# Altium project OBCv1.6FE.PrjPcb (part 1 of 2)
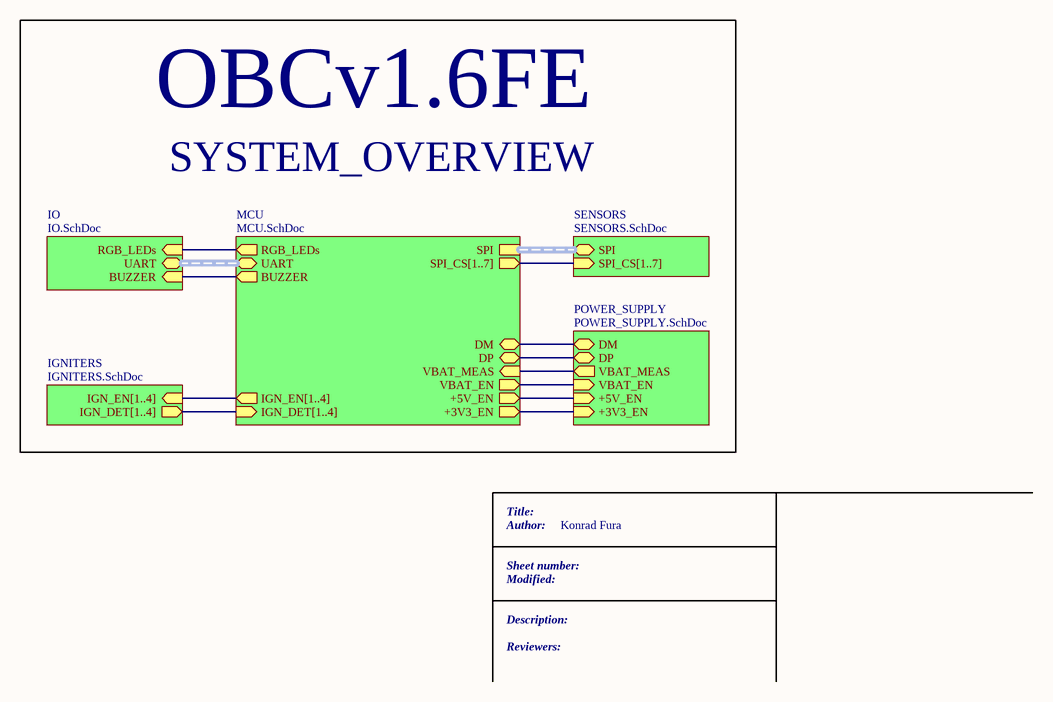
[diagram p0: SYSTEM_OVERVIEW.SchDoc]
6 sheets, 194 parts. Net scope: hierarchical (ports join the sheet entries above them; power ports are global).
Board file: OBCv1.6FE.PcbDoc
Sheets:
  SYSTEM_OVERVIEW.SchDoc
    MCU = MCU.SchDoc
    IO = IO.SchDoc
    SENSORS = SENSORS.SchDoc
    IGNITERS = IGNITERS.SchDoc
    POWER_SUPPLY = POWER_SUPPLY.SchDoc

## Sheet SYSTEM_OVERVIEW.SchDoc
size 254 x 177 mm; SheetNumber: 1; SheetTotal: 6

### Sub-sheets
IGNITERS = IGNITERS.SchDoc: IGN_EN[1..4] (in), IGN_DET[1..4] (out)
IO = IO.SchDoc: RGB_LEDs (in), UART (bidir), BUZZER (in)
MCU = MCU.SchDoc: DM (bidir), DP (bidir), IGN_DET[1..4] (in), IGN_EN[1..4] (out), RGB_LEDs (out), VBAT_EN (out), UART (bidir), VBAT_MEAS (in), SPI, SPI_CS[1..7] (out), +5V_EN (out), +3V3_EN (out), BUZZER (out)
POWER_SUPPLY = POWER_SUPPLY.SchDoc: VBAT_MEAS (out), DM (bidir), DP (bidir), VBAT_EN (in), +5V_EN (in), +3V3_EN (in)
SENSORS = SENSORS.SchDoc: SPI (bidir), SPI_CS[1..7] (in)

### Nets
GPIO15: sheet MCU/RGB_LEDs, sheet IO/RGB_LEDs
GPIO22: sheet MCU/BUZZER, sheet IO/BUZZER
GPIO23: sheet MCU/+5V_EN, sheet POWER_SUPPLY/+5V_EN
GPIO24: sheet MCU/+3V3_EN, sheet POWER_SUPPLY/+3V3_EN
GPIO25: sheet MCU/VBAT_EN, sheet POWER_SUPPLY/VBAT_EN
NetR1_2: sheet MCU/DP, sheet POWER_SUPPLY/DP
NetR2_2: sheet MCU/DM, sheet POWER_SUPPLY/DM
NetR63_1: sheet MCU/VBAT_MEAS, sheet POWER_SUPPLY/VBAT_MEAS

### Buses and harness runs
bus sheet IGNITERS/IGN_DET[1..4] = sheet MCU/IGN_DET[1..4]
bus sheet IGNITERS/IGN_EN[1..4] = sheet MCU/IGN_EN[1..4]
bus sheet MCU/SPI_CS[1..7] = sheet SENSORS/SPI_CS[1..7]
harness sheet IO/UART = sheet MCU/UART
harness sheet MCU/SPI = sheet SENSORS/SPI

### Notes on the sheet
- OBCv1.6FE
- SYSTEM_OVERVIEW
- Title:
- Author:
- Konrad Fura
- Sheet number:
- Modified:
- Description:
- Reviewers:

## Sheet MCU.SchDoc
size 340 x 299 mm; SheetNumber: 2; SheetTotal: 6
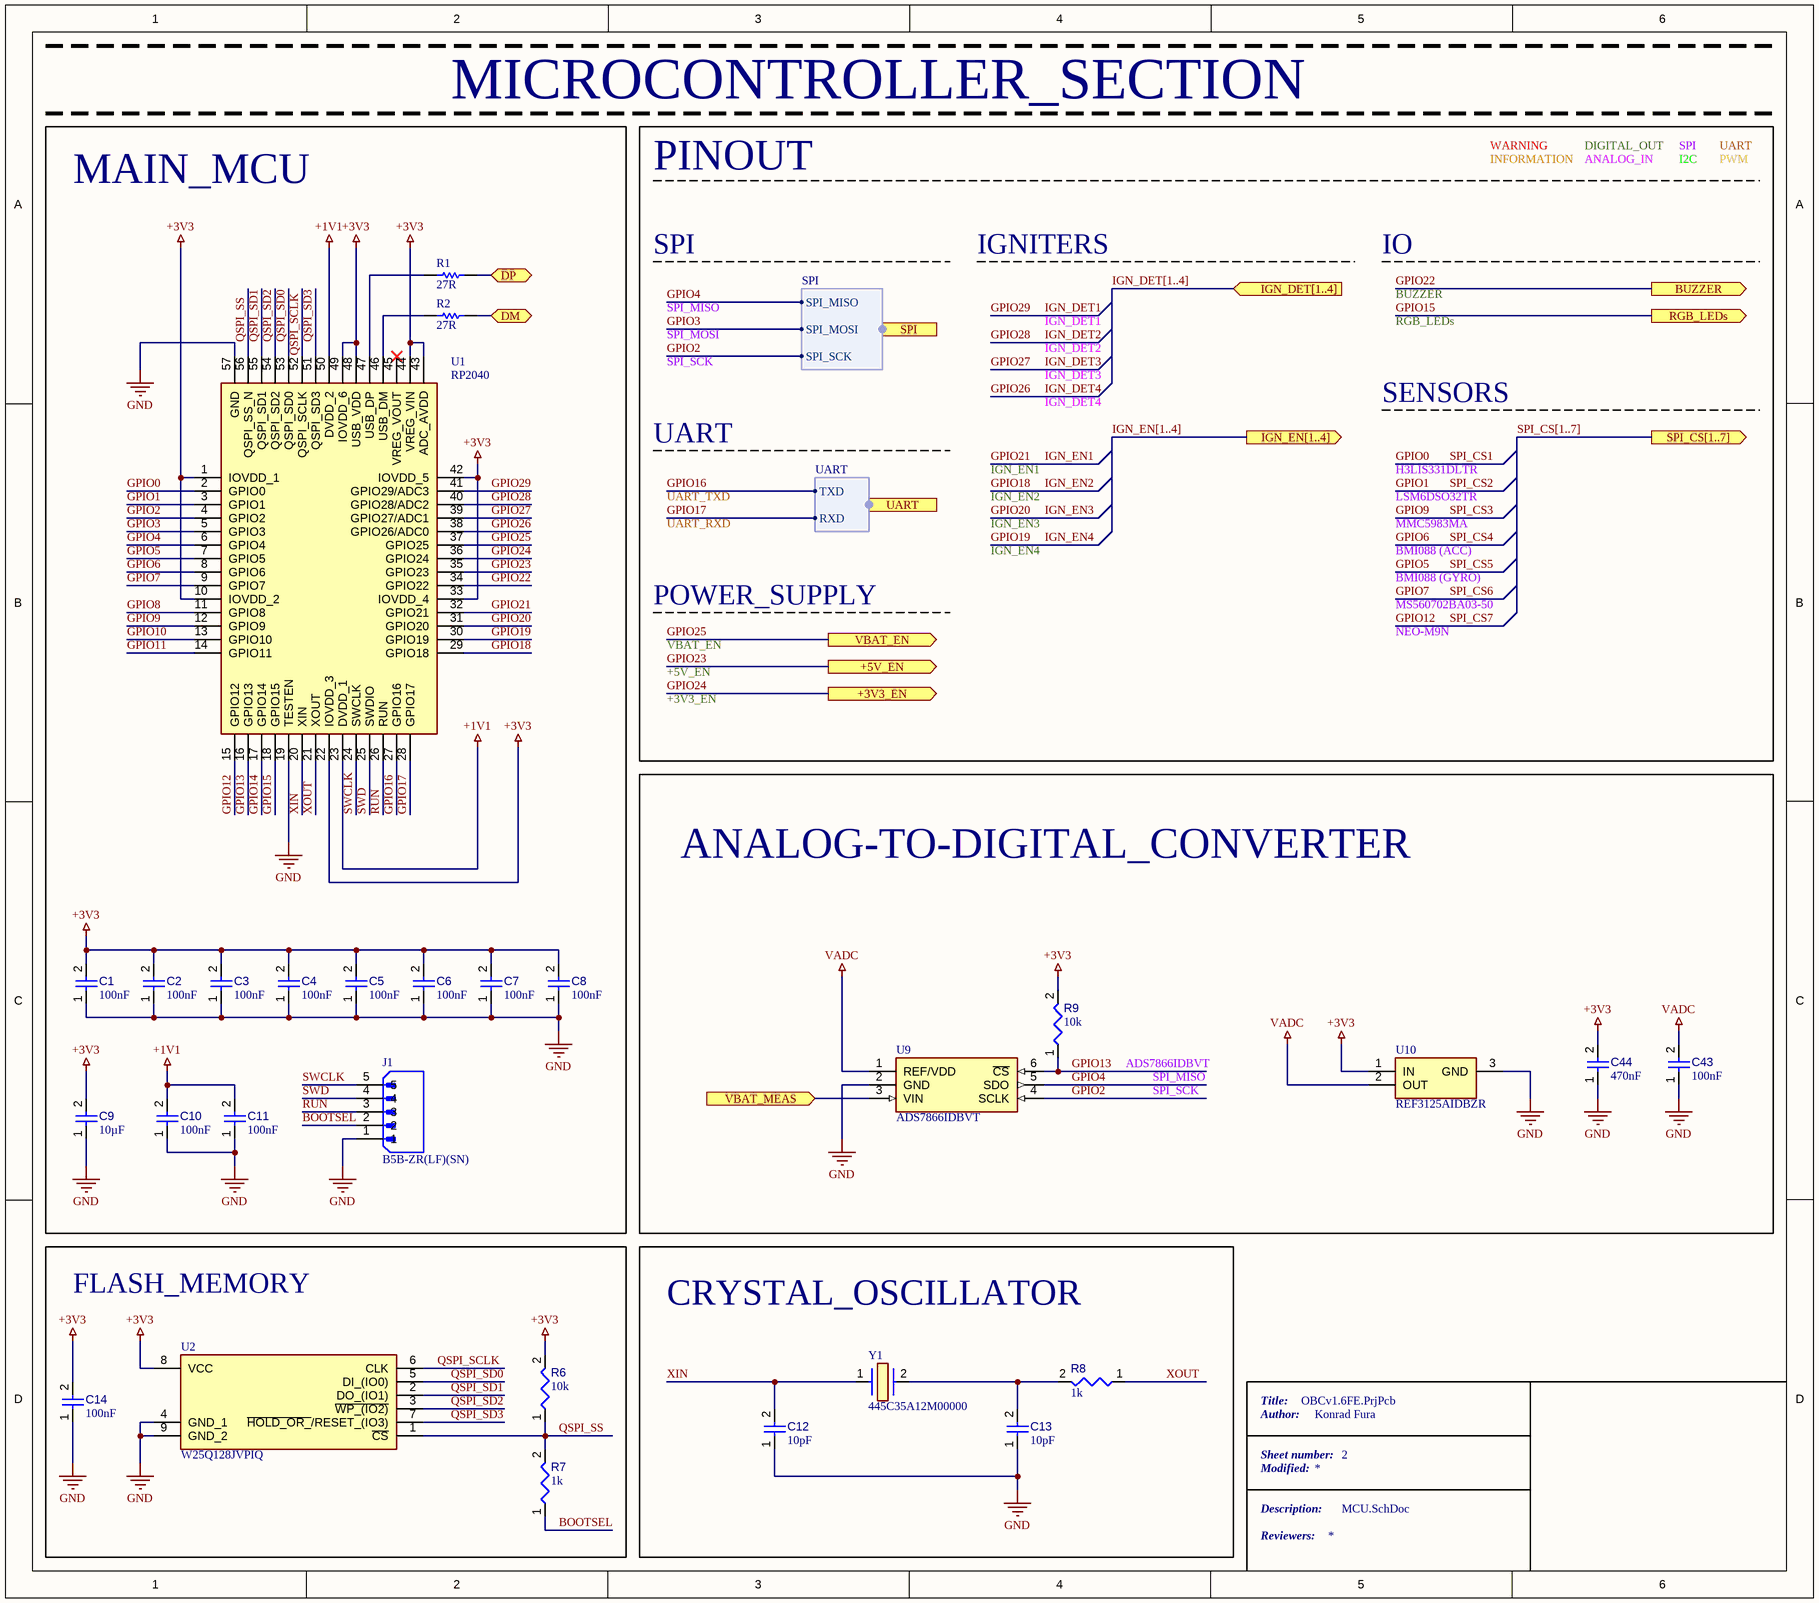
[diagram p1: MCU.SchDoc]

### Parts
C1  value 100nF  [CAPC0402(1005)60_L]  (hidden comment: Capacitor 100nF +/-20% 10V 0402)
C2  value 100nF  [CAPC0402(1005)60_L]  (hidden comment: Capacitor 100nF +/-20% 10V 0402)
C3  value 100nF  [CAPC0402(1005)60_L]  (hidden comment: Capacitor 100nF +/-20% 10V 0402)
C4  value 100nF  [CAPC0402(1005)60_L]  (hidden comment: Capacitor 100nF +/-20% 10V 0402)
C5  value 100nF  [CAPC0402(1005)60_L]  (hidden comment: Capacitor 100nF +/-20% 10V 0402)
C6  value 100nF  [CAPC0402(1005)60_L]  (hidden comment: Capacitor 100nF +/-20% 10V 0402)
C7  value 100nF  [CAPC0402(1005)60_L]  (hidden comment: Capacitor 100nF +/-20% 10V 0402)
C8  value 100nF  [CAPC0402(1005)60_L]  (hidden comment: Capacitor 100nF +/-20% 10V 0402)
C9  value 10µF  [CAPC3216X180X50NL20T25]  (hidden comment: Capacitor 10 uF +/- 10% 16 V 1206)
C10  value 100nF  [CAPC0402(1005)60_L]  (hidden comment: Capacitor 100nF +/-20% 10V 0402)
C11  value 100nF  [CAPC0402(1005)60_L]  (hidden comment: Capacitor 100nF +/-20% 10V 0402)
C12  value 10pF  [CAPC1005X55X30LL05T10]  (hidden comment: Capacitor 10 pF +/- 0.25 pF 50 V 0402)
C13  value 10pF  [CAPC1005X55X30LL05T10]  (hidden comment: Capacitor 10 pF +/- 0.25 pF 50 V 0402)
C14  value 100nF  [CAPC0402(1005)60_L]  (hidden comment: Capacitor 100nF +/-20% 10V 0402)
C43  value 100nF  [CAPC0402(1005)60_L]  (hidden comment: Capacitor 100nF +/-20% 10V 0402)
C44  value 470nF  [CAPC0402(1005)60_L]  (hidden comment: Capacitor 470nF +/-40% 10V 0402)
J1  B5B-ZR(LF)(SN)  [JST_B5B-ZR(LF)(SN)]
R1  27R  [RESC1005X40X25NL05T05]
R2  27R  [RESC1005X40X25NL05T05]
R6  value 10k  [RESC0402(1005)_L]  (hidden comment: Resistor 10K  +/-1 % 0402 63 mW)
R7  value 1k  [RESC0402(1005)_L]  (hidden comment: Resistor 1K +/-5 % 0402 63 mW)
R8  value 1k  [RESC0402(1005)_L]  (hidden comment: Resistor 1K +/-5 % 0402 63 mW)
R9  value 10k  [RESC0402(1005)_L]  (hidden comment: Resistor 10K  +/-1 % 0402 63 mW)
U1  RP2040  [QFN40P700X700X90-57N-D]
U2  W25Q128JVPIQ  [SON127P600X500X80-9N-D]
U9  ADS7866IDBVT  [SOT95P280X145-6N]
U10  REF3125AIDBZR  [SOT95P237X112-3N]
Y1  445C35A12M00000  [445I23D24M00000]

### Blocks framed on the sheet
MICROCONTROLLER_SECTION: C1-C11 J1 R1 R2 U1
ANALOG-TO-DIGITAL_CONVERTER: C43 C44 R9 U9 U10
FLASH_MEMORY: C14 R6 R7 U2
CRYSTAL_OSCILLATOR: C12 C13 R8 Y1

### Ports
+3V3_EN (out, see SYSTEM_OVERVIEW[4C], POWER_SUPPLY[1C]), +5V_EN (out, see SYSTEM_OVERVIEW[4C], POWER_SUPPLY[1D]), BUZZER (out, see SYSTEM_OVERVIEW[3C], IO[5C]), DM (bidir, see SYSTEM_OVERVIEW[4C], POWER_SUPPLY[4C]), DP (bidir, see SYSTEM_OVERVIEW[4C], POWER_SUPPLY[4C]), IGN_DET[1..4] (in, see SYSTEM_OVERVIEW[3C], IGNITERS[2D]), IGN_EN[1..4] (out, see SYSTEM_OVERVIEW[3C], IGNITERS[3D]), RGB_LEDs (out, see SYSTEM_OVERVIEW[3C], IO[1A]), SPI (harness SPI, see SYSTEM_OVERVIEW[4C], SENSORS[1B]), SPI_CS[1..7] (out, see SYSTEM_OVERVIEW[4C], SENSORS[1A]), UART (harness UART, see SYSTEM_OVERVIEW[3C], IO[3C]), VBAT_EN (out, see SYSTEM_OVERVIEW[4C], POWER_SUPPLY[1B]), VBAT_MEAS (in, see SYSTEM_OVERVIEW[4C], POWER_SUPPLY[6C])

### Harnesses
UART: TXD, RXD
SPI: SPI_MISO, SPI_MOSI, SPI_SCK

### Nets
+1V1: C10.2 C11.2 U1.23(DVDD_1) U1.50(DVDD_2)
+3V3: C1.2 C2.2 C3.2 C4.2 C5.2 C6.2 C7.2 C8.2 C9.2 C14.2 C44.2 R6.2 R9.2 U1.1(IOVDD_1) U1.10(IOVDD_2) U1.22(IOVDD_3) U1.33(IOVDD_4) U1.42(IOVDD_5) U1.43(ADC_AVDD) U1.44(VREG_VIN) U1.48(USB_VDD) U1.49(IOVDD_6) U2.8(VCC) U10.1(IN)
GND: C1.1 C2.1 C3.1 C4.1 C5.1 C6.1 C7.1 C8.1 C9.1 C10.1 C11.1 C12.1 C13.1 C14.1 C43.1 C44.1 J1.1 U1.19(TESTEN) U1.57(GND) U2.4(GND_1) U2.9(GND_2) U9.2(GND) U10.3(GND)
VADC: C43.2 U9.1(REF/VDD) U10.2(OUT)
BOOTSEL: J1.2 R7.1
GPIO0: U1.2(GPIO0)  [also labelled SPI_CS1]
GPIO1: U1.3(GPIO1)  [also labelled SPI_CS2]
GPIO2: U1.4(GPIO2) U9.4(SCLK) ; port SPI.SPI_SCK
GPIO3: U1.5(GPIO3) ; port SPI.SPI_MOSI
GPIO4: U1.6(GPIO4) U9.5(SDO) ; port SPI.SPI_MISO
GPIO5: U1.7(GPIO5)  [also labelled SPI_CS5]
GPIO6: U1.8(GPIO6)  [also labelled SPI_CS4]
GPIO7: U1.9(GPIO7)  [also labelled SPI_CS6]
GPIO8: U1.11(GPIO8)
GPIO9: U1.12(GPIO9)  [also labelled SPI_CS3]
GPIO10: U1.13(GPIO10)
GPIO11: U1.14(GPIO11)
GPIO12: U1.15(GPIO12)  [also labelled SPI_CS7]
GPIO13: R9.1 U1.16(GPIO13) U9.6(~{CS})
GPIO14: U1.17(GPIO14)
GPIO15: U1.18(GPIO15) ; port RGB_LEDs
GPIO16: U1.27(GPIO16) ; port UART.TXD
GPIO17: U1.28(GPIO17) ; port UART.RXD
GPIO18: U1.29(GPIO18)  [also labelled IGN_EN2]
GPIO19: U1.30(GPIO19)  [also labelled IGN_EN4]
GPIO20: U1.31(GPIO20)  [also labelled IGN_EN3]
GPIO21: U1.32(GPIO21)  [also labelled IGN_EN1]
GPIO22: U1.34(GPIO22) ; port BUZZER
GPIO23: U1.35(GPIO23) ; port +5V_EN
GPIO24: U1.36(GPIO24) ; port +3V3_EN
GPIO25: U1.37(GPIO25) ; port VBAT_EN
GPIO26: U1.38(GPIO26/ADC0)  [also labelled IGN_DET4]
GPIO27: U1.39(GPIO27/ADC1)  [also labelled IGN_DET3]
GPIO28: U1.40(GPIO28/ADC2)  [also labelled IGN_DET2]
GPIO29: U1.41(GPIO29/ADC3)  [also labelled IGN_DET1]
QSPI_SCLK: U1.52(QSPI_SCLK) U2.6(CLK)
QSPI_SD0: U1.53(QSPI_SD0) U2.5(DI_(IO0))
QSPI_SD1: U1.55(QSPI_SD1) U2.2(DO_(IO1))
QSPI_SD2: U1.54(QSPI_SD2) U2.3(~{WP_(IO2)})
QSPI_SD3: U1.51(QSPI_SD3) U2.7(~{HOLD_OR_}/RESET_(IO3))
QSPI_SS: R6.1 R7.2 U1.56(QSPI_SS_N) U2.1(~{CS})
RUN: J1.3 U1.26(RUN)
SWCLK: J1.5 U1.24(SWCLK)
SWD: J1.4 U1.25(SWDIO)
XIN: C12.2 U1.20(XIN) Y1.1
XOUT: R8.1 U1.21(XOUT)
NetC13_2: C13.2 R8.2 Y1.2
NetR1_1: R1.1 U1.47(USB_DP)
NetR1_2: R1.2 ; port DP
NetR2_1: R2.1 U1.46(USB_DM)
NetR2_2: R2.2 ; port DM
NetR63_1: U9.3(VIN) ; port VBAT_MEAS

Not connected (* = marked no-connect by the designer): U1 45(VREG_VOUT)*

### Buses and harness runs
bus IGN_DET[1..4] = port IGN_DET[1..4]
bus IGN_EN[1..4] = port IGN_EN[1..4]
bus SPI_CS[1..7] = port SPI_CS[1..7]

### Notes on the sheet
- MAIN_MCU
- PINOUT
- WARNING
- INFORMATION
- DIGITAL_OUT
- ANALOG_IN
- SPI
- I2C
- UART
- PWM
- IGNITERS
- IO
- SPI_MISO
- SPI_MOSI
- IGN_DET1
- RGB_LEDs
- BUZZER
- SPI_SCK
- IGN_DET2
- IGN_DET3
- IGN_DET4
- SENSORS
- IGN_EN1
- H3LIS331DLTR
- UART_TXD
- UART_RXD
- IGN_EN2
- IGN_EN3
- LSM6DSO32TR
- MMC5983MA
- POWER_SUPPLY
- IGN_EN4
- BMI088 (ACC)
- BMI088 (GYRO)
- MS560702BA03-50
- VBAT_EN
- +5V_EN
- NEO-M9N
- +3V3_EN
- ADS7866IDBVT
- Title:
- Author:
- Konrad Fura
- Sheet number:
- Modified:
- Description:
- Reviewers:
- THIS DOCUMENT AND THE DATA DISCLOSED HEREIN OR
- HEREWITH IS THE PROPERTY OF ALTIUM LIMITED AND MAY
- DWG NO:
- REVISION
- REV:
- DESCRIPTION
- DATE
- APPROVED
- BE FREELY DISTRIBUTED IN WHOLE. NO RIGHTS ARE
- RESERVED OR EXPRESS OR IMPLIED WARANTEE GIVEN.
- ENG:
- APPROVALS
- PROJECT
- DSN:
- CHK:
- REFERENCE DOCUMENTS
- PROJECT REVISION:
- TITLE
- DOCUMENT REVISION:
- DESIGN ITEM:
- BOM:
- FAB DWG:
- PCB DWG:
- ASSY DWG:
- SCALE:
- A3
- SIZE
- CAGE CODE
- FILE NAME
- DWG NO.
- SHEET
- OF
- REV

### Library data of the parts
C1-C8 C10 C11 C14 C43 = CMP-001-00061-3: Chip Capacitor, 100nF +/-20%, 10V, 0402, Thickness 0.6 mm; Tolerance: 20%; Mounting Technology: SMT; Voltage Rating: 10V; Max Operating Temperature: 85°C; Pins: 2; Case/Package: 0402; Min Operating Temperature: -55°C
C9 = CMP-001-00016-6: Chip Capacitor, 10 uF, +/- 10%, 16 V, 1206 (3216 Metric); Capacitor Type: Ceramic; Voltage Rating: 16V; Tolerance: 10%; Min Operating Temperature: -55°C; Pins: 2; Mounting Technology: SM; Case/Package: 1206; Max Operating Temperature: 125°C; RoHS Compliant: True
C12 C13 = CMP-001-00011-6: Chip Capacitor, 10 pF, +/- 0.25 pF, 50 V, 0402 (1005 Metric); Voltage Rating: 50V; Tolerance: 0.25%; Capacitor Type: Ceramic; Mounting Technology: SM; Pins: 2; Case/Package: 0402; Min Operating Temperature: -55°C; RoHS Compliant: True; Max Operating Temperature: 125°C
C44 = CMP-001-00060-4: Chip Capacitor, 470nF +/-40%, 10V, 0402, Thickness 0.6 mm; Tolerance: 20%; Max Operating Temperature: 85°C; Case/Package: 0402; Voltage Rating: 10V; Min Operating Temperature: -55°C; Mounting Technology: SMT; Pins: 2
J1 = B5B-ZR(LF)(SN): MF: {'manufacturer': u'JST'}; Package: None; Price: None; Value: *; MP: B5B-ZR(LF)(SN); Availability: Unavailable
R1 R2 = CMP-2002-08435-1: Manufacturer: Vishay Dale; Part Number: CRCW040227R0JNED
R6 R9 = CMP-009-00149-3: Chip Resistor, 10 kOhms, +/-1 %, 63 mW, -55 to 125 degC, 0402; Power: 63mW; Tolerance: 1%; Min Operating Temperature: -55°C; Case/Package: 0402; Max Operating Temperature: 155°C; Pins: 2
R7 R8 = CMP-009-00157-3: Chip Resistor, 1 kOhms, +/-5 %, 63 mW, -55 to 155 degC, 0402; Tolerance: 5%; Power: 63mW; Case/Package: 0402; Pins: 2; Min Operating Temperature: -55°C; Max Operating Temperature: 155°C
U1 = CMP-005-000252-1: Integrated Circuit; Manufacturer_Part_Number: RPI Chip RP2040-10-10; Manufacturer_Name: RASPBERRY-PI; Source: SamacSys.SchLib; Mouser Part Number: 358-RP2040CHIP-10-10; Datasheet Link: https://datasheets.raspberrypi.com/rp2040/rp2040-datasheet.pdf; Design Item ID: RPI_Chip_RP2040-10-10; Mouser Price/Stock: https://www.mouser.co.uk/ProductDetail/Raspberry-Pi/RPI-Chip-RP2040-10-10?qs=QNEnbhJQKva2vG4DZ5VuhA%3D%3D; Height: 0.9mm
U2 = W25Q128JVPIQ: Integrated Circuit; Manufacturer_Name: Winbond; Datasheet Link: https://www.winbond.com/hq/search-resource-file.jsp?partNo=W25Q128JVPIQ&type=datasheet; Height: 0.8mm; Manufacturer_Part_Number: W25Q128JVPIQ; Mouser Part Number: 454-W25Q128JVPIQ; Mouser Price/Stock: https://www.mouser.co.uk/ProductDetail/Winbond/W25Q128JVPIQ?qs=qSfuJ%252Bfl%2Fd676hAD%252B1JSfw%3D%3D; Arrow Part Number: W25Q128JVPIQ; Arrow Price/Stock: https://www.arrow.com/en/products/w25q128jvpiq/winbond-electronics?region=nac
U9 = ADS7866IDBVT: Integrated Circuit; Manufacturer_Name: Texas Instruments; Datasheet Link: http://www.ti.com/lit/ds/symlink/ads7868.pdf; Height: 1.45mm; Manufacturer_Part_Number: ADS7866IDBVT; Mouser Part Number: 595-ADS7866IDBVT; Mouser Price/Stock: https://www.mouser.co.uk/ProductDetail/Texas-Instruments/ADS7866IDBVT/?qs=%252BvKcWiXw%252BzS702eoPmcsqA%3D%3D; Arrow Part Number: ADS7866IDBVT; Arrow Price/Stock: https://www.arrow.com/en/products/ads7866idbvt/texas-instruments
U10 = REF3125AIDBZR: Power Supply; Manufacturer_Name: Texas Instruments; Datasheet Link: http://www.ti.com/lit/gpn/ref3125; Height: 1.12mm; Manufacturer_Part_Number: REF3125AIDBZR; Mouser Part Number: 595-REF3125AIDBZR; Mouser Price/Stock: https://www.mouser.co.uk/ProductDetail/Texas-Instruments/REF3125AIDBZR?qs=sSOk4GDDv7yGr49TvB900g%3D%3D; Arrow Part Number: REF3125AIDBZR; Arrow Price/Stock: https://www.arrow.com/en/products/ref3125aidbzr/texas-instruments?region=nac
Y1 = 445I23D12M00000: Crystal or Oscillator; Manufacturer_Name: CTS; Datasheet Link: https://www.ctscorp.com/wp-content/uploads/445.pdf; Height: 1.35mm; Manufacturer_Part_Number: 445I23D12M00000; Mouser Part Number: 774-445I23D12M00000; Mouser Price/Stock: https://www.mouser.co.uk/ProductDetail/CTS-Electronic-Components/445I23D12M00000?qs=FP1Nkeq3mZ%252B08JSIL2fBKw%3D%3D; Arrow Part Number: 445I23D12M00000; Arrow Price/Stock: https://www.arrow.com/en/products/445i23d12m00000/cts

## Sheet IO.SchDoc
size 292 x 203 mm; SheetNumber: 3; SheetTotal: 6
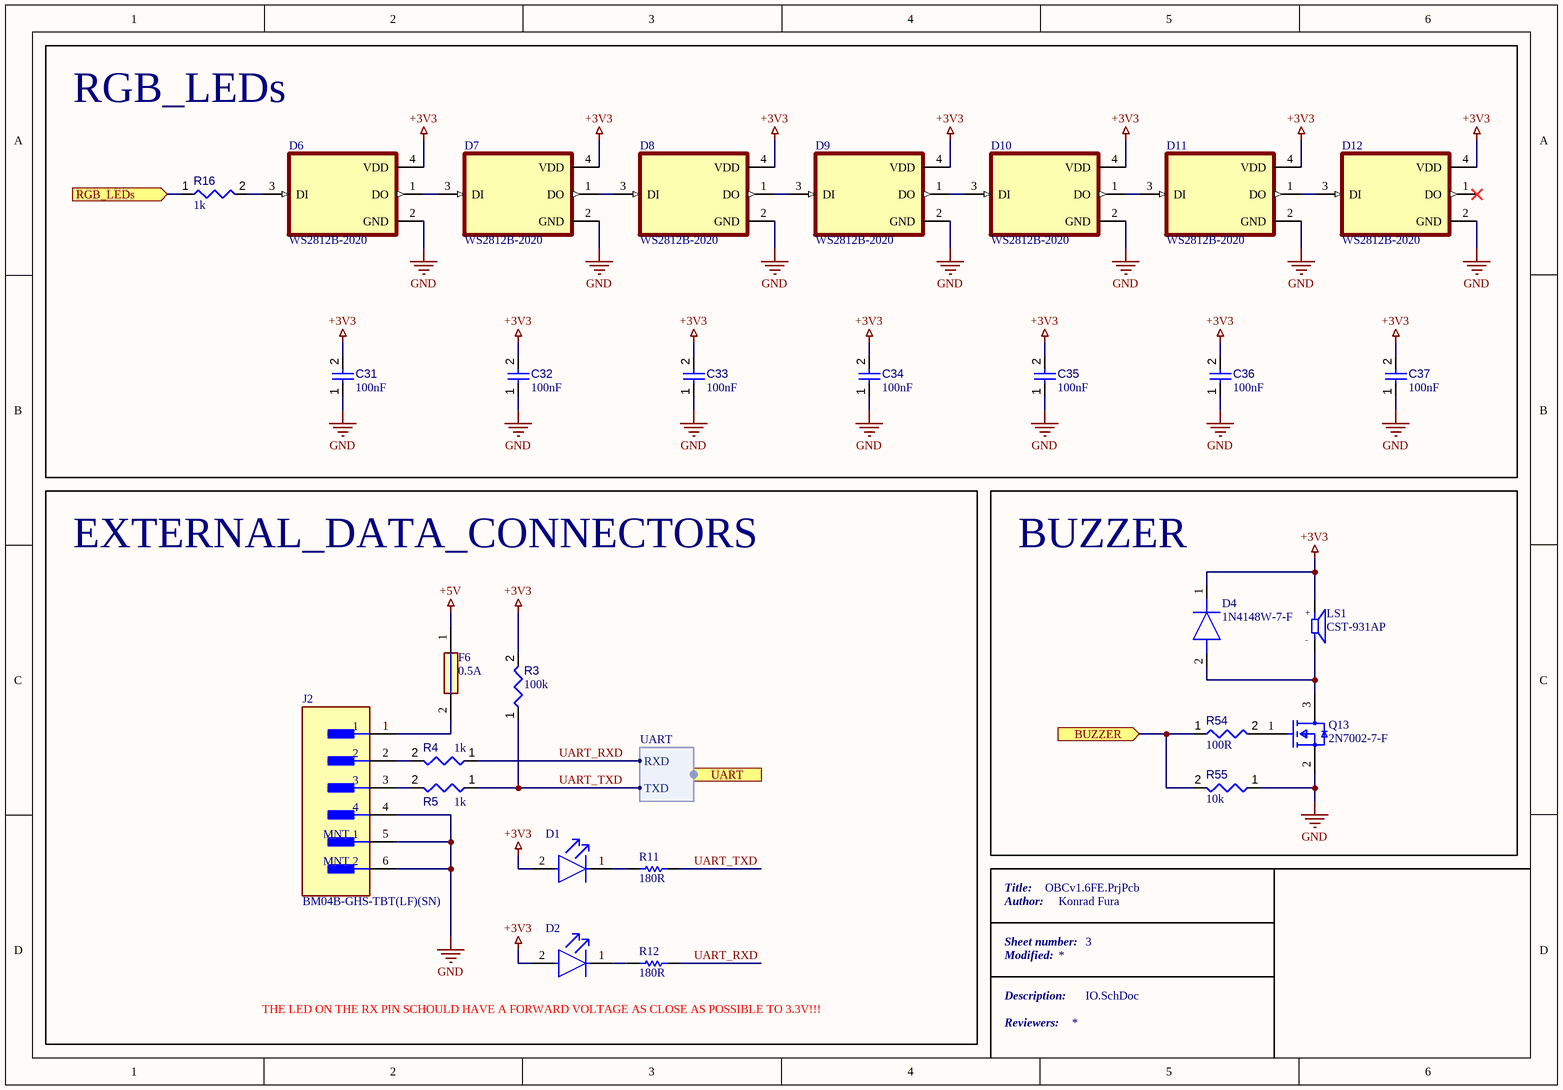
[diagram p2: IO.SchDoc]

### Parts
C31  value 100nF  [CAPC0402(1005)60_L]  (hidden comment: Capacitor 100nF +/-20% 10V 0402)
C32  value 100nF  [CAPC0402(1005)60_L]  (hidden comment: Capacitor 100nF +/-20% 10V 0402)
C33  value 100nF  [CAPC0402(1005)60_L]  (hidden comment: Capacitor 100nF +/-20% 10V 0402)
C34  value 100nF  [CAPC0402(1005)60_L]  (hidden comment: Capacitor 100nF +/-20% 10V 0402)
C35  value 100nF  [CAPC0402(1005)60_L]  (hidden comment: Capacitor 100nF +/-20% 10V 0402)
C36  value 100nF  [CAPC0402(1005)60_L]  (hidden comment: Capacitor 100nF +/-20% 10V 0402)
C37  value 100nF  [CAPC0402(1005)60_L]  (hidden comment: Capacitor 100nF +/-20% 10V 0402)
D1  (no value)  [FP-LTST-C191TBKT-MFG]
D2  (no value)  [FP-LTST-C191TBKT-MFG]
D4  1N4148W-7-F  [SOD3716X145N]
D6  WS2812B-2020  [LED_WS2812-2020]
D7  WS2812B-2020  [LED_WS2812-2020]
D8  WS2812B-2020  [LED_WS2812-2020]
D9  WS2812B-2020  [LED_WS2812-2020]
D10  WS2812B-2020  [LED_WS2812-2020]
D11  WS2812B-2020  [LED_WS2812-2020]
D12  WS2812B-2020  [LED_WS2812-2020]
F6  0.5A  [FUSC2114X75N]
J2  BM04B-GHS-TBT(LF)(SN)  [FP-BM04B-GHS-TBT_LF_SN-MFG]
LS1  CST-931AP  [CUI_CST-931AP]
Q13  2N7002-7-F  [FP-SOT23-MFG]
R3  value 100k  [RESC0402(1005)_L]  (hidden comment: Resistor 100K +/-1 % 0402 63 mW)
R4  value 1k  [RESC0402(1005)_L]  (hidden comment: Resistor 1K +/-5 % 0402 63 mW)
R5  value 1k  [RESC0402(1005)_L]  (hidden comment: Resistor 1K +/-5 % 0402 63 mW)
R11  180R  [RESC1005X40X25NL05T05]
R12  180R  [RESC1005X40X25NL05T05]
R16  value 1k  [RESC0402(1005)_L]  (hidden comment: Resistor 1K +/-5 % 0402 63 mW)
R54  value 100R  [RESC0402(1005)_L]  (hidden comment: Resistor 100R +/-1 % 0402 63 mW)
R55  value 10k  [RESC0402(1005)_L]  (hidden comment: Resistor 10K  +/-1 % 0402 63 mW)

### Blocks framed on the sheet
RGB_LEDs: C31-C37 D6-D12 R16
EXTERNAL_DATA_CONNECTORS: D1 D2 F6 J2 R3-R5 R11 R12
BUZZER: D4 LS1 Q13 R54 R55

### Ports
BUZZER (in, see SYSTEM_OVERVIEW[3C], MCU[6A]), RGB_LEDs (in, see SYSTEM_OVERVIEW[3C], MCU[6A]), UART (harness UART, see SYSTEM_OVERVIEW[3C], MCU[3B])

### Harnesses
UART: RXD, TXD

### Nets
+3V3: C31.2 C32.2 C33.2 C34.2 C35.2 C36.2 C37.2 D1.2(A) D2.2(A) D4.1(K) D6.4(VDD) D7.4(VDD) D8.4(VDD) D9.4(VDD) D10.4(VDD) D11.4(VDD) D12.4(VDD) LS1.P R3.2
+5V: F6.1
GND: C31.1 C32.1 C33.1 C34.1 C35.1 C36.1 C37.1 D6.2(GND) D7.2(GND) D8.2(GND) D9.2(GND) D10.2(GND) D11.2(GND) D12.2(GND) J2.4 J2.5(MNT_1) J2.6(MNT_2) Q13.2(S) R55.1
GPIO15: R16.1 ; port RGB_LEDs
GPIO22: R54.1 R55.2 ; port BUZZER
UART_RXD: R4.1 R12.2 ; port UART.RXD  [project net GPIO17]
UART_TXD: R3.1 R5.1 R11.2 ; port UART.TXD  [project net GPIO16]
NetD1_1: D1.1(C) R11.1
NetD2_1: D2.1(C) R12.1
NetD4_2: D4.2(A) LS1.M Q13.3(D)
NetD6_1: D6.1(DO) D7.3(DI)
NetD6_3: D6.3(DI) R16.2
NetD7_1: D7.1(DO) D8.3(DI)
NetD8_1: D8.1(DO) D9.3(DI)
NetD9_1: D9.1(DO) D10.3(DI)
NetD10_1: D10.1(DO) D11.3(DI)
NetD11_1: D11.1(DO) D12.3(DI)
NetF6_2: F6.2 J2.1
NetJ2_2: J2.2 R4.2
NetJ2_3: J2.3 R5.2
NetQ13_1: Q13.1(G) R54.2

Not connected (* = marked no-connect by the designer): D12 1(DO)*

### Notes on the sheet
- Title:
- Author:
- Konrad Fura
- Sheet number:
- Modified:
- THE LED ON THE RX PIN SCHOULD HAVE A FORWARD VOLTAGE AS CLOSE AS POSSIBLE TO 3.3V!!!
- Description:
- Reviewers:
- (in symbol CST-931AP) +; -

### Library data of the parts
C31-C37 = CMP-001-00061-3: as C1 on sheet MCU; Mounting Technology: SMT; Voltage Rating: 10V; Max Operating Temperature: 85°C; Pins: 2; Case/Package: 0402; Min Operating Temperature: -55°C
D1 D2 = CMP-22017-000008-1: LED BLUE CLEAR CHIP SMD; Lens Color: Colorless; Dominant Wavelength: 475nm; Forward Current: 20mA; Wavelength: 468nm; Viewing Angle: 130°; Power Dissipation: 76mW; Luminous Intensity: 180mcd; Reverse Voltage: 5V; Number of Elements: 1; Lens Style: Diffused; Forward Voltage: 3.8V; Max Power Dissipation: 75mW; Case Code (Metric): 1608; Packaging: Tape and Reel; Case/Package: 0603; Depth: 1.6mm; Mount: Surface Mount; Lead Free: Lead Free; Min Operating Temperature: -20°C; Lens Transparency: Clear; Illumination Color: Blue; Height: 0.55mm; Test Current: 20mA; Case Code (Imperial): 0603; Max Operating Temperature: 80°C; Number of Pins: 2; Length: 0.8mm; Radiation Hardening: No; Package Quantity: 1; Number of LEDs: 1; Width: 0.8mm; Color: Blue
D4 = 1N4148W-7-F: Diode; Manufacturer_Name: Diodes Inc.; Datasheet Link: https://componentsearchengine.com/Datasheets/2/1N4148W-7-F.pdf; Height: 1.45mm; Manufacturer_Part_Number: 1N4148W-7-F; Mouser Part Number: 621-1N4148W-F; Mouser Price/Stock: https://www.mouser.co.uk/ProductDetail/Diodes-Incorporated/1N4148W-7-F?qs=LHX0FizJzg7Ae9ZM8LTAWw%3D%3D; Arrow Part Number: 1N4148W-7-F; Arrow Price/Stock: https://www.arrow.com/en/products/1n4148w-7-f/diodes-incorporated?region=europe
D6-D12 = WS2812-2020: Intelligent control LED integrated light source; MF: {'manufacturer': u'Worldsemi'}; Availability: Unavailable; Value: *; Package: None; Price: None; MP: WS2812-2020
F6 = 0805L020_24YR: Fuse; Manufacturer_Name: LITTELFUSE; Manufacturer_Part_Number: 0805L020/24YR; Datasheet Link: https://m.littelfuse.com/media?resourcetype=datasheets&itemid=3b1fa5dc-24aa-4363-b543-edb057c2fffa&filename=littelfuse-ptc-0805l-datasheet; Height: 0.75mm; Mouser Part Number: 576-0805L020/24YR; Mouser Price/Stock: https://www.mouser.co.uk/ProductDetail/Littelfuse/0805L020-24YR?qs=AQlKX63v8Rtx0r%252BHTgklTQ%3D%3D
J2 = CMP-17439-000062-2: CONN HEADER SMD 4POS 1.25MM; Number of Positions: 4; Wire/Cable Gauge: 26AWG; Current Rating: 1A; Voltage Rating (AC): 50V; Gender: Male; Orientation: Straight; Max Operating Temperature: 85°C; Pitch: 1.25mm; Contact Plating: Tin; Number of Rows: 4; Series: GH; Min Operating Temperature: -25°C; REACH SVHC: No SVHC; Packaging: Cut Tape; Lead Free: Lead Free; Voltage Rating: 50V; Contact Material: Bronze; Number of Contacts: 4; Termination: Crimp; Case/Package: SMD/SMT; Housing Color: Natural; Housing Material: Nylon
LS1 = CST-931AP: 9 mm, 3 V, 85 dB, Through Hole, Magnetic Audio Transducer Buzzer; MF: {'manufacturer': u'CUI Devices'}; Package: None; Price: None; Value: *; MP: CST-931AP; Availability: Unavailable
Q13 = CMP-2000-04929-2: MOSFET N-CH 60V 115MA SOT23-3; Turn-On Delay Time: 7ns; Turn-Off Delay Time: 11ns; Drain to Source Resistance: 7.5R; Rise Time: 3ns; Drain to Source Breakdown Voltage: 70V; Input Capacitance: 50pF; Number of Elements: 1; Power Dissipation: 540mW; Max Power Dissipation: 300mW; Fall Time: 5.6ns; Gate to Source Voltage (Vgs): 20V; Threshold Voltage: 2.5V; Element Configuration: Single; Termination: SMD/SMT; Weight: 0.000282oz; Radiation Hardening: No; Max Operating Temperature: 150°C; On-State Resistance: 7.5R; Mount: Surface Mount; Current Rating: 115mA; Contact Plating: Tin; Lead Free: Lead Free; Min Operating Temperature: -55°C; Number of Pins: 3; REACH SVHC: No SVHC; Drain to Source Voltage (Vdss): 60V; Width: 1.3mm; Package Quantity: 3000; Length: 2.9mm; Case/Package: SOT-23; Number of Channels: 1; Dual Supply Voltage: 60V; Packaging: Tape and Reel; Height: 1mm; Voltage Rating (DC): 60V; Nominal Vgs: 2.5V; Continuous Drain Current (ID): 115mA; Voltage: 60V; Rds On Max: 7.5R
R3 = CMP-009-00168-3: Chip Resistor, 100 kOhms, +/-1 %, 63 mW, -55 to 155 degC, 0402; Tolerance: 1%; Power: 63mW; Max Operating Temperature: 155°C; Min Operating Temperature: -55°C; Pins: 2; Case/Package: 0402
R4 R5 R16 = CMP-009-00157-3: as R7 on sheet MCU; Case/Package: 0402; Pins: 2; Min Operating Temperature: -55°C; Max Operating Temperature: 155°C
R11 R12 = CMP-2002-01127-1: Manufacturer: Panasonic; Part Number: ERJ2RKF1800X
R54 = CMP-009-00167-3: Chip Resistor, 100 Ohms, +/-1 %, 63 mW, -55 to 155 degC, 0402; Power: 63mW; Tolerance: 1%; Min Operating Temperature: -55°C; Case/Package: 0402; Pins: 2; Max Operating Temperature: 155°C
R55 = CMP-009-00149-3: as R6 on sheet MCU; Min Operating Temperature: -55°C; Case/Package: 0402; Max Operating Temperature: 155°C; Pins: 2

## Sheet SENSORS.SchDoc
size 393 x 261 mm; SheetNumber: 5; SheetTotal: 6
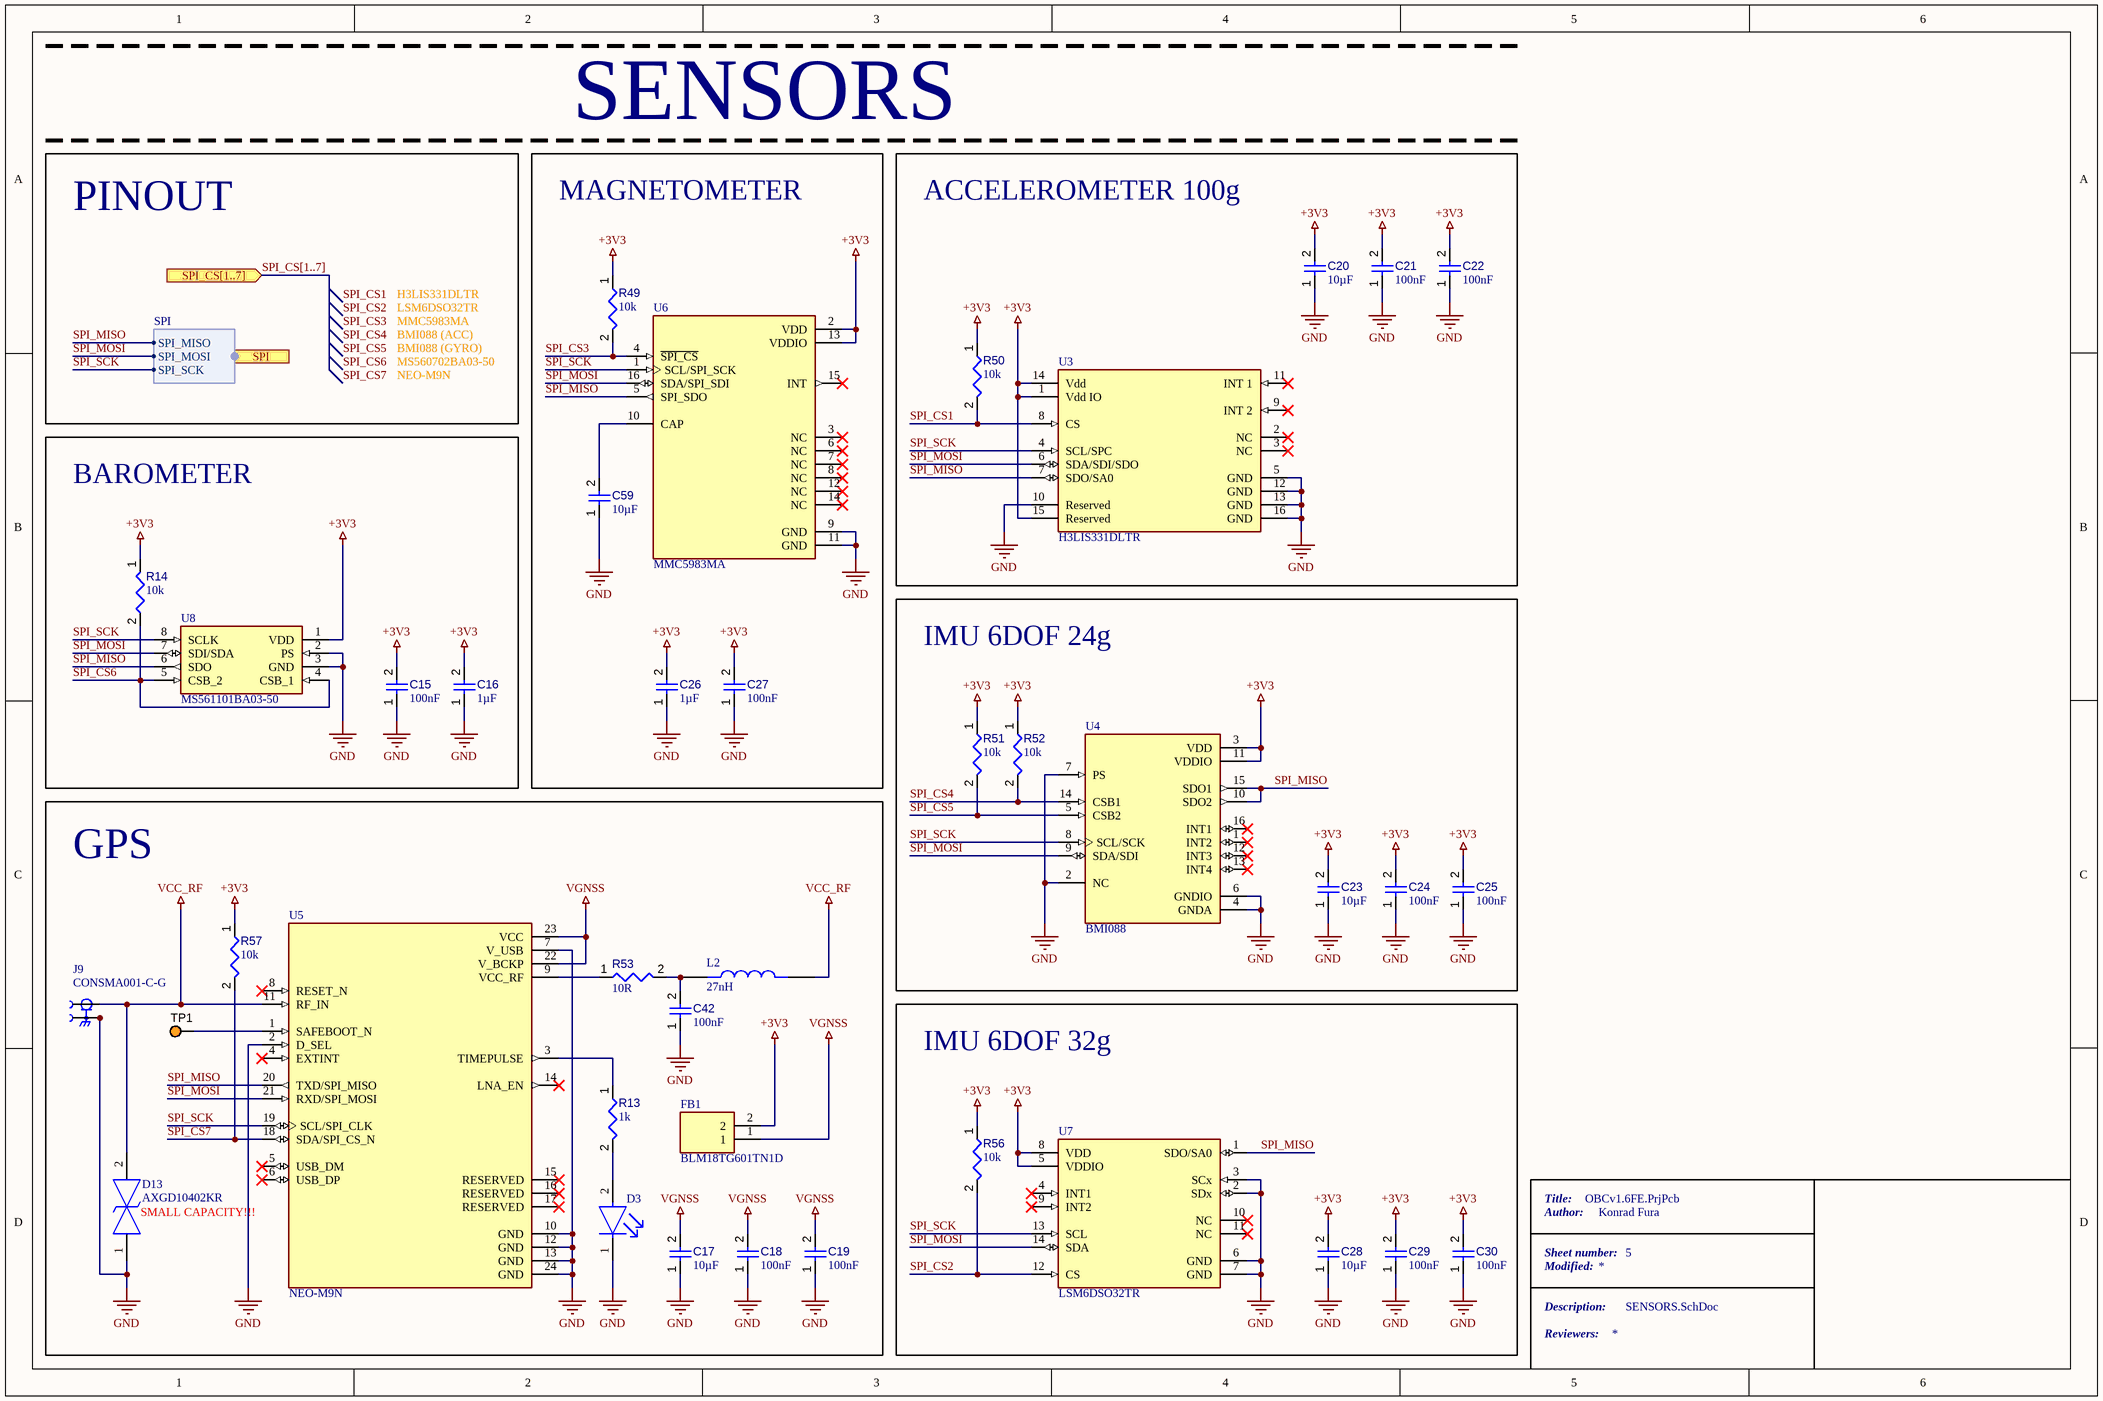
[diagram p3: SENSORS.SchDoc]

### Parts
C15  value 100nF  [CAPC0402(1005)60_L]  (hidden comment: Capacitor 100nF +/-20% 10V 0402)
C16  value 1µF  [CAPC0402(1005)60_L]  (hidden comment: Capacitor 1µF +/-20% 10V 0402)
C17  value 10µF  [CAPC0603(1608)100_L]  (hidden comment: Capacitor 10µF +/-20% 10V 0603)
C18  value 100nF  [CAPC0402(1005)60_L]  (hidden comment: Capacitor 100nF +/-20% 10V 0402)
C19  value 100nF  [CAPC0402(1005)60_L]  (hidden comment: Capacitor 100nF +/-20% 10V 0402)
C20  value 10µF  [CAPC0603(1608)100_L]  (hidden comment: Capacitor 10µF +/-20% 10V 0603)
C21  value 100nF  [CAPC0402(1005)60_L]  (hidden comment: Capacitor 100nF +/-20% 10V 0402)
C22  value 100nF  [CAPC0402(1005)60_L]  (hidden comment: Capacitor 100nF +/-20% 10V 0402)
C23  value 10µF  [CAPC0603(1608)100_L]  (hidden comment: Capacitor 10µF +/-20% 10V 0603)
C24  value 100nF  [CAPC0402(1005)60_L]  (hidden comment: Capacitor 100nF +/-20% 10V 0402)
C25  value 100nF  [CAPC0402(1005)60_L]  (hidden comment: Capacitor 100nF +/-20% 10V 0402)
C26  value 1µF  [CAPC0402(1005)60_L]  (hidden comment: Capacitor 1µF +/-20% 10V 0402)
C27  value 100nF  [CAPC0402(1005)60_L]  (hidden comment: Capacitor 100nF +/-20% 10V 0402)
C28  value 10µF  [CAPC0603(1608)100_L]  (hidden comment: Capacitor 10µF +/-20% 10V 0603)
C29  value 100nF  [CAPC0402(1005)60_L]  (hidden comment: Capacitor 100nF +/-20% 10V 0402)
C30  value 100nF  [CAPC0402(1005)60_L]  (hidden comment: Capacitor 100nF +/-20% 10V 0402)
C42  value 100nF  [CAPC0402(1005)60_L]  (hidden comment: Capacitor 100nF +/-20% 10V 0402)
C59  value 10µF  [CAPC0603(1608)100_L]  (hidden comment: Capacitor 10µF +/-20% 10V 0603)
D3  D3  [FP-LTST-C191TBKT-MFG]  (value not drawn)
D13  AXGD10402KR  [DIONM105X51N]
FB1  BLM18TG601TN1D  [BLM18EG101TH1D]
J9  CONSMA001-C-G  [LINX_CONSMA001-C-G]
L2  27nH  [INDC1005X65N]
R13  value 1k  [RESC0402(1005)_L]  (hidden comment: Resistor 1K +/-5 % 0402 63 mW)
R14  value 10k  [RESC0402(1005)_L]  (hidden comment: Resistor 10K  +/-1 % 0402 63 mW)
R49  value 10k  [RESC0402(1005)_L]  (hidden comment: Resistor 10K  +/-1 % 0402 63 mW)
R50  value 10k  [RESC0402(1005)_L]  (hidden comment: Resistor 10K  +/-1 % 0402 63 mW)
R51  value 10k  [RESC0402(1005)_L]  (hidden comment: Resistor 10K  +/-1 % 0402 63 mW)
R52  value 10k  [RESC0402(1005)_L]  (hidden comment: Resistor 10K  +/-1 % 0402 63 mW)
R53  value 10R  [RESC0402(1005)_L]  (hidden comment: Resistor 10R  +/-1 % 0402 63 mW)
R56  value 10k  [RESC0402(1005)_L]  (hidden comment: Resistor 10K  +/-1 % 0402 63 mW)
R57  value 10k  [RESC0402(1005)_L]  (hidden comment: Resistor 10K  +/-1 % 0402 63 mW)
TP1  5003  [KSTN-5003]  (value not drawn)
U3  H3LIS331DLTR  [FP-TFLGA16-7983231-MFG]
U4  BMI088  [PQFN50P450X300X100-16N]
U5  NEO-M9N  [XCVR_NEO-M9N]
U6  MMC5983MA  [PQFN50P300X300X100-16N]
U7  LSM6DSO32TR  [FP-LGA-14L-DM00249496-MFG]
U8  MS561101BA03-50  [MS561101BA03-50]

### Blocks framed on the sheet
SENSORS: C26 C27 C59 R49 U6
ACCELEROMETER 100g: C20-C22 R50 U3
BAROMETER: C15 C16 R14 U8
IMU 6DOF 24g: C23-C25 R51 R52 U4
GPS: C17-C19 C42 D3 D13 FB1 J9 L2 R13 R53 R57 TP1 U5
IMU 6DOF 32g: C28-C30 R56 U7

### Ports
SPI (harness SPI, see SYSTEM_OVERVIEW[4C], MCU[3A]), SPI_CS[1..7] (in, see SYSTEM_OVERVIEW[4C], MCU[6A])

### Harnesses
SPI: SPI_MISO, SPI_MOSI, SPI_SCK

### Nets
+3V3: C15.2 C16.2 C20.2 C21.2 C22.2 C23.2 C24.2 C25.2 C26.2 C27.2 C28.2 C29.2 C30.2 FB1.2 R14.1 R49.1 R50.1 R51.1 R52.1 R56.1 R57.1 U3.1(Vdd_IO) U3.14(Vdd) U3.15(Reserved) U4.3(VDD) U4.11(VDDIO) U6.2(VDD) U6.13(VDDIO) U7.5(VDDIO) U7.8(VDD) U8.1(VDD)
GND: C15.1 C16.1 C17.1 C18.1 C19.1 C20.1 C21.1 C22.1 C23.1 C24.1 C25.1 C26.1 C27.1 C28.1 C29.1 C30.1 C42.1 C59.1 D3.1(C) D13.1 J9.S1 J9.S2 J9.S3 J9.S4 U3.5(GND) U3.10(Reserved) U3.12(GND) U3.13(GND) U3.16(GND) U4.2(NC) U4.4(GNDA) U4.6(GNDIO) U4.7(PS) U5.2(D_SEL) U5.7(V_USB) U5.10(GND) U5.12(GND) U5.13(GND) U5.24(GND) U6.9(GND) U6.11(GND) U7.2(SDx) U7.3(SCx) U7.6(GND) U7.7(GND) U8.2(PS) U8.3(GND)
VCC_RF: D13.2 J9.1 L2.2 U5.11(RF_IN)
VGNSS: C17.2 C18.2 C19.2 FB1.1 U5.22(V_BCKP) U5.23(VCC)
SPI_CS1: R50.2 U3.8(CS)  [project net GPIO0]
SPI_CS2: R56.2 U7.12(CS)  [project net GPIO1]
SPI_CS3: R49.2 U6.4(~{SPI_CS})  [project net GPIO9]
SPI_CS4: R52.2 U4.14(CSB1)  [project net GPIO6]
SPI_CS5: R51.2 U4.5(CSB2)  [project net GPIO5]
SPI_CS6: R14.2 U8.4(CSB_1) U8.5(CSB_2)  [project net GPIO7]
SPI_CS7: R57.2 U5.18(SDA/SPI_CS_N)  [project net GPIO12]
SPI_MISO: U3.7(SDO/SA0) U4.10(SDO2) U4.15(SDO1) U5.20(TXD/SPI_MISO) U6.5(SPI_SDO) U7.1(SDO/SA0) U8.6(SDO) ; port SPI.SPI_MISO  [project net GPIO4]
SPI_MOSI: U3.6(SDA/SDI/SDO) U4.9(SDA/SDI) U5.21(RXD/SPI_MOSI) U6.16(SDA/SPI_SDI) U7.14(SDA) U8.7(SDI/SDA) ; port SPI.SPI_MOSI  [project net GPIO3]
SPI_SCK: U3.4(SCL/SPC) U4.8(SCL/SCK) U5.19(SCL/SPI_CLK) U6.1(SCL/SPI_SCK) U7.13(SCL) U8.8(SCLK) ; port SPI.SPI_SCK  [project net GPIO2]
NetC42_2: C42.2 L2.1 R53.2
NetC59_2: C59.2 U6.10(CAP)
NetD3_2: D3.2(A) R13.2
NetR13_1: R13.1 U5.3(TIMEPULSE)
NetR53_1: R53.1 U5.9(VCC_RF)
NetTP1_1: TP1.1 U5.1(SAFEBOOT_N)

Not connected (* = marked no-connect by the designer): U3 2(NC)* 3(NC)* 9(INT_2)* 11(INT_1)*; U4 1(INT2)* 12(INT3)* 13(INT4)* 16(INT1)*; U5 4(EXTINT)* 5(USB_DM)* 6(USB_DP)* 8(RESET_N)* 14(LNA_EN)* 15(RESERVED)* 16(RESERVED)* 17(RESERVED)*; U6 3(NC)* 6(NC)* 7(NC)* 8(NC)* 12(NC)* 14(NC)* 15(INT)*; U7 4(INT1)* 9(INT2)* 10(NC)* 11(NC)*

### Buses and harness runs
bus SPI_CS[1..7] = port SPI_CS[1..7]

### Notes on the sheet
- MAGNETOMETER
- PINOUT
- H3LIS331DLTR
- LSM6DSO32TR
- MMC5983MA
- BMI088 (ACC)
- BMI088 (GYRO)
- MS560702BA03-50
- NEO-M9N
- (near D13) SMALL CAPACITY!!!
- Title:
- Author:
- Konrad Fura
- Sheet number:
- Modified:
- Description:
- Reviewers:
- Labels drawn without touching a wire or pin: SPI_CS1, SPI_CS2, SPI_CS3, SPI_CS4, SPI_CS5, SPI_CS6, SPI_CS7

### Library data of the parts
C15 C18 C19 C21 C22 C24 C25 C27 C29 C30 C42 = CMP-001-00061-3: as C1 on sheet MCU; Mounting Technology: SMT; Voltage Rating: 10V; Max Operating Temperature: 85°C; Pins: 2; Case/Package: 0402; Min Operating Temperature: -55°C
C16 C26 = CMP-001-00063-3: Chip Capacitor, 1µF +/-20%, 10V, 0402, Thickness 0.6 mm; Tolerance: 10%; Mounting Technology: SMT; Max Operating Temperature: 85°C; Voltage Rating: 10V; Pins: 2; Case/Package: 0402; Min Operating Temperature: -55°C
C17 C20 C23 C28 C59 = CMP-001-00075-4: Chip Capacitor, 10µF +/-20%, 10V, 0603, Thickness 1 mm; Tolerance: 10%; Voltage Rating: 10V; Max Operating Temperature: 85°C; Pins: 2; Case/Package: 0603; Mounting Technology: SMT; Min Operating Temperature: -55°C
D3 = CMP-22017-000008-1: as D1 on sheet IO; Case Code (Metric): 1608; Packaging: Tape and Reel; Case/Package: 0603; Depth: 1.6mm; Mount: Surface Mount; Lead Free: Lead Free; Min Operating Temperature: -20°C; Lens Transparency: Clear; Illumination Color: Blue; Height: 0.55mm; Test Current: 20mA; Case Code (Imperial): 0603; Max Operating Temperature: 80°C; Number of Pins: 2; Length: 0.8mm; Radiation Hardening: No; Package Quantity: 1; Number of LEDs: 1; Width: 0.8mm; Color: Blue
D13 = AXGD10402KR: TVS Diode (Bi-directional); Manufacturer_Name: LITTELFUSE; Datasheet Link: https://www.littelfuse.com/~/media/electronics/datasheets/polymer_esd_suppressors/littelfuse_xtremeguard_axgd_datasheet.pdf.pdf; Height: 0.51mm; Manufacturer_Part_Number: AXGD10402KR; Mouser Part Number: 576-AXGD10402KR; Mouser Price/Stock: https://www.mouser.co.uk/ProductDetail/Littelfuse/AXGD10402KR?qs=%252BdQmOuGyFcFxx0p0UGW3NA%3D%3D; Arrow Part Number: AXGD10402KR; Arrow Price/Stock: https://www.arrow.com/en/products/axgd10402kr/littelfuse?region=nac
FB1 = BLM18TG601TN1D: Ferrite Bead; Manufacturer_Name: Murata Electronics; Datasheet Link: http://www.murata.com/~/media/webrenewal/support/library/catalog/products/emc/emifil/c31e.ashx?la=en-gb; Height: 0.75mm; Manufacturer_Part_Number: BLM18TG601TN1D; Mouser Part Number: 81-BLM18TG601TN1D; Mouser Price/Stock: https://www.mouser.co.uk/ProductDetail/Murata-Electronics/BLM18TG601TN1D/?qs=%2F%252BYoplLUB5j4EvNKGf%252BxGQ%3D%3D; Arrow Part Number: BLM18TG601TN1D; Arrow Price/Stock: https://www.arrow.com/en/products/blm18tg601tn1d/murata-manufacturing?region=nac
J9 = CONSMA001-C-G: <a href="https://pricing.snapeda.com/parts/CONSMA001-C-G/Linx%20Technologies/view-part?ref=eda">Check availability</a> <a href="https://pricing.snapeda.com/parts/CONSMA001-C-G/Linx%20Technologies/view-part?ref=eda">Check availability</a>; MF: {'manufacturer': u'Linx Technologies'}; Package: None; Price: None; Value: *; MP: CONSMA001-C-G; Availability: Unavailable
L2 = AIMC-0402-27NJ-T: IND 27nH 0.3A 1000mâ„¦; MF: {'manufacturer': u'Abracon'}; Package: None; Price: None; Value: *; MP: AIMC-0402-27NJ-T; Availability: Unavailable
R13 = CMP-009-00157-3: as R7 on sheet MCU; Case/Package: 0402; Pins: 2; Min Operating Temperature: -55°C; Max Operating Temperature: 155°C
R14 R49-R52 R56 R57 = CMP-009-00149-3: as R6 on sheet MCU; Min Operating Temperature: -55°C; Case/Package: 0402; Max Operating Temperature: 155°C; Pins: 2
R53 = CMP-009-00152-3: Chip Resistor, 10 Ohms, +/-1 %, 63 mW, -55 to 155 degC, 0402; Tolerance: 1%; Power: 63mW; Pins: 2; Max Operating Temperature: 155°C; Min Operating Temperature: -55°C; Case/Package: 0402
TP1 = CMP-002-00037-2: Test Point, Orange, Height 4.6 mm, Tail Length 3 mm, 1-Pin THD, RoHS; Manufacturer: Keystone; Colour: Orange; Packaging: Bulk; Package Description: 1-Pin Through Hole Device, Dia 2.54 mm; Pins: 1; Package Reference: 5003; Datasheet Version: Jun-15; Case/Package: 5003; Mounting Technology: TH; Connector Type: TestPoint; Diameter: 2.54mm; Contact Material: Bronze; Datasheet URL: http://keyelco.com/userAssets/file/M65p56.pdf; Manufacturer URL: http://www.keyelco.com/; Package Quantity: 10; Contact Plating: Tin; RoHS Compliant: True
U3 = CMP-12175-000002-1: ACCEL 100-400G I2C/SPI 16TFLGA; Manufacturer: STMicroelectronics; Min Supply Voltage: 2.16V; Accel Axis: X+Y and Z; Sensor Output: I2C,SPI; Accel Resolution: 16bits; Operating Supply Current: 10-300uA; Accel Range: 100/200/400g; Max Supply Voltage: 3.6V; Temperature: -40°C to +85°C; Octopart: https://octopart.com/h3lis331dltr-stmicroelectronics-29186499; Automotive: No; Digikey Description: ACCEL 100-400G I2C/SPI 16TFLGA; Device Class L3: Accelerometers; ComponentLink2URL: https://www.st.com/resource/en/datasheet/h3lis331dl.pdf; Device Class L2: Motion Sensors; Package: TFLGA16-7983231; Mouser Description: Accelerometer Triple +/-100g/+/-200g/+/-400g 2.5V 16-Pin TFLGA T/R; ComponentLink2Description: Datasheet; Device Class L1: Sensors; Lead Free: Yes; RoHS: TRUE; Footprint Url: https://www.st.com/content/ccc/resource/technical/document/technical_note/73/17/9c/16/dd/96/4a/01/CD00134799.pdf/files/CD00134799.pdf/jcr:content/translations/en.CD00134799.pdf; Height: 1mm; Category: IC; Manufacturer Part Number: H3LIS331DLTR; Temperature Range Low: -40°C; Temperature Range High: +85°C
U4 = BMI088: High-performance 6-axis inertial sensor (accelerometer + gyroscope) <a href="https://pricing.snapeda.com/parts/BMI088/Bosch%20Sensortec/view-part?ref=eda">Check prices</a>; MF: {'manufacturer': u'Bosch Sensortec'}; Availability: Unavailable; Value: *; Package: None; Price: None; MP: BMI088
U5 = NEO-M9N: MF: {'manufacturer': u'U-Blox'}; Package: None; Price: None; Value: *; MP: NEO-M9N; Availability: Unavailable
U6 = MMC5983MA: MMC5983 series Magnetic, Magnetometer Sensor Evaluation Board; MF: {'manufacturer': u'Memsic Inc.'}; Availability: Unavailable; Package: None; MP: MMC5983MA; Value: *; Price: None
U7 = CMP-12177-000015-1: INEMO INERTIAL MODULE: 3D ACCELE
U8 = MS561101BA03-50: Integrated Circuit; Manufacturer_Name: TE Connectivity; Datasheet Link: https://www.te.com/commerce/DocumentDelivery/DDEController?Action=srchrtrv&DocNm=MS5611-01BA03&DocType=Data%20Sheet&DocLang=English&PartCntxt=MS561101BA03-50&DocFormat=pdf; Manufacturer_Part_Number: MS561101BA03-50; Mouser Part Number: 824-MS561101BA03-50; Mouser Price/Stock: https://www.mouser.co.uk/ProductDetail/Measurement-Specialties/MS561101BA03-50?qs=%252BgKeJhng5iV%252BnCz6Qd5iDw%3D%3D; Arrow Part Number: MS561101BA03-50; Arrow Price/Stock: https://www.arrow.com/en/products/ms561101ba03-50/te-connectivity?region=nac

## Sheet IGNITERS.SchDoc
size 297 x 281 mm; SheetNumber: 6; SheetTotal: 6
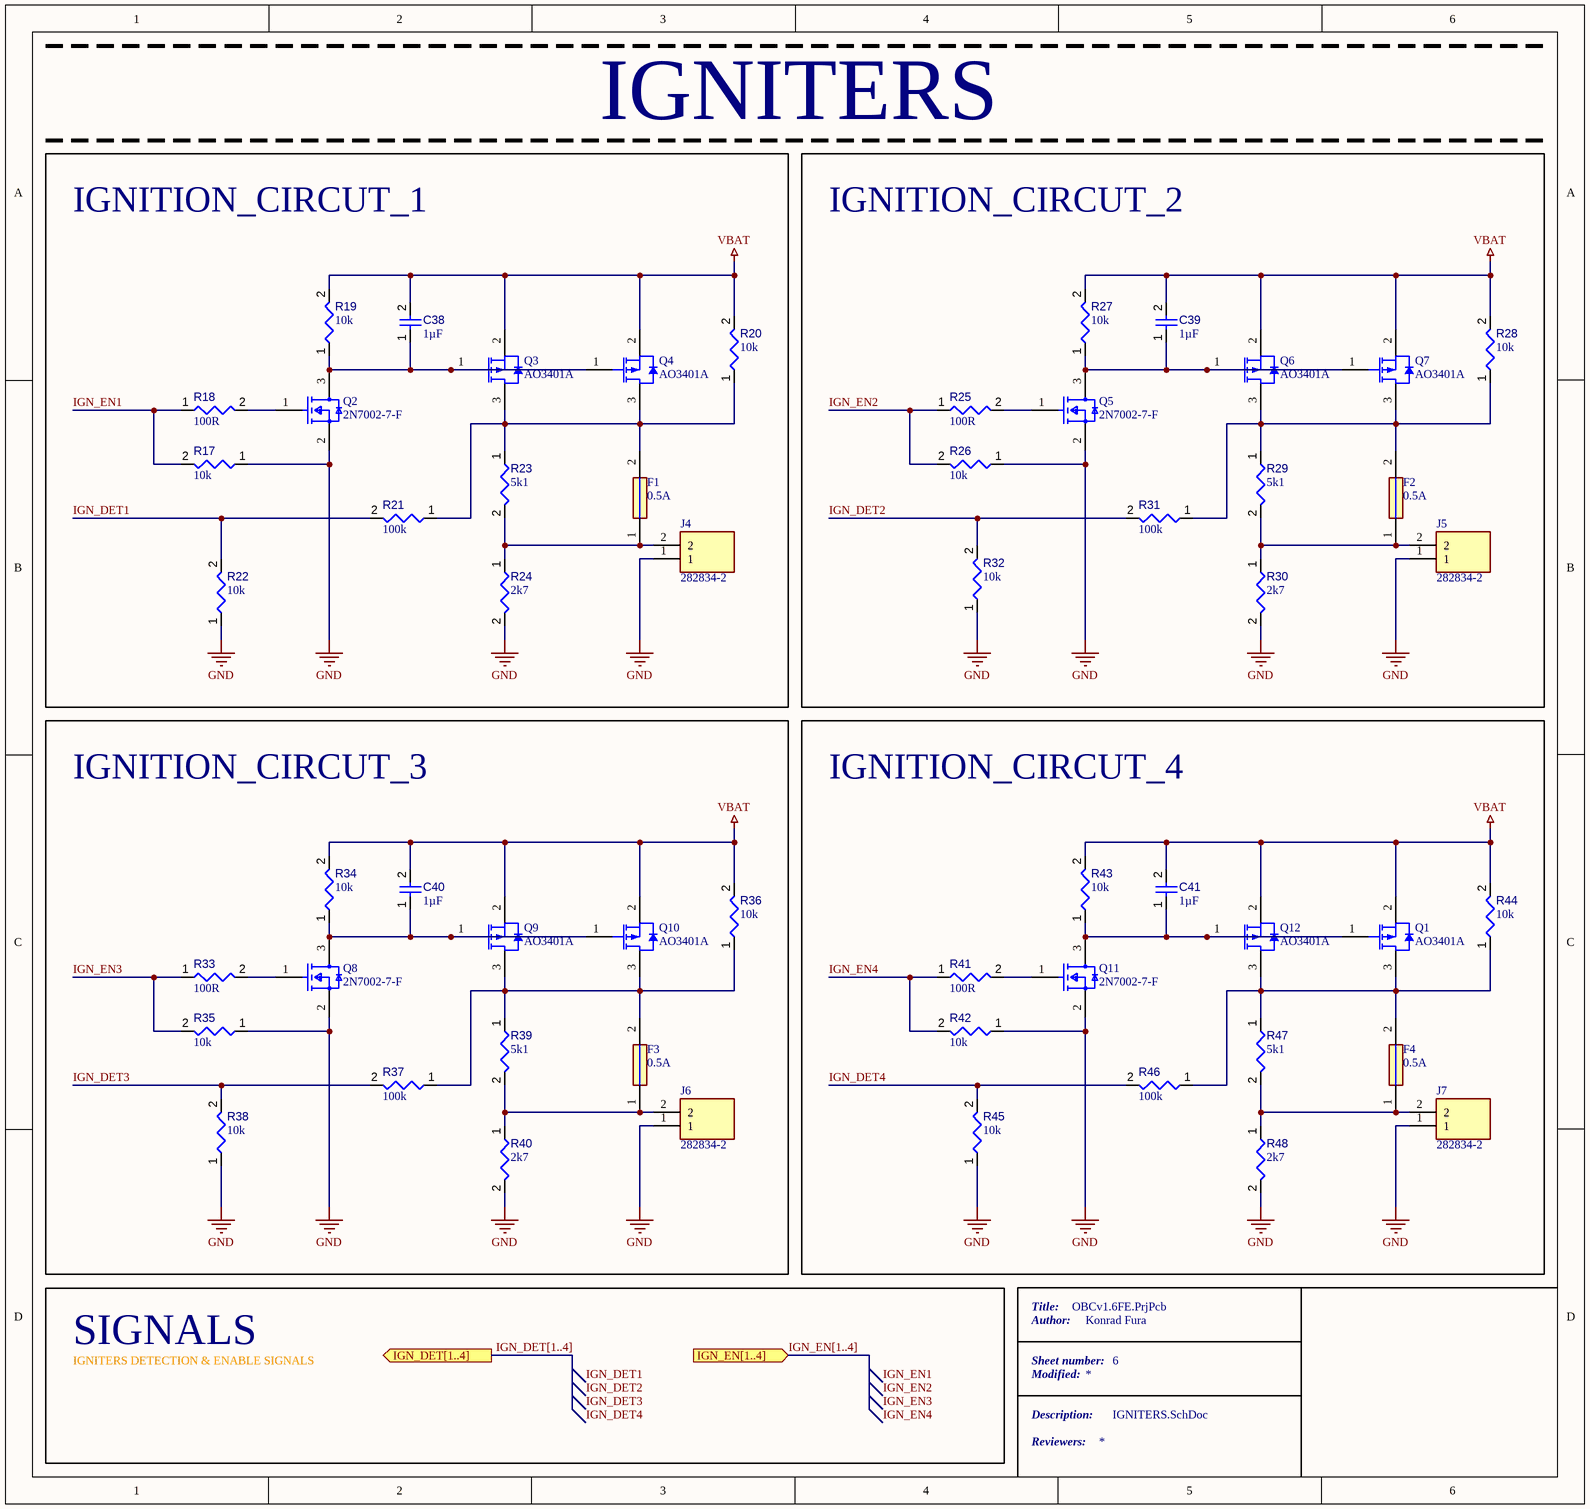
[diagram p4: IGNITERS.SchDoc]

### Parts
C38  value 1µF  [CAPC0402(1005)60_L]  (hidden comment: Capacitor 1µF +/-20% 10V 0402)
C39  value 1µF  [CAPC0402(1005)60_L]  (hidden comment: Capacitor 1µF +/-20% 10V 0402)
C40  value 1µF  [CAPC0402(1005)60_L]  (hidden comment: Capacitor 1µF +/-20% 10V 0402)
C41  value 1µF  [CAPC0402(1005)60_L]  (hidden comment: Capacitor 1µF +/-20% 10V 0402)
F1  0.5A  [FUSC2114X75N]
F2  0.5A  [FUSC2114X75N]
F3  0.5A  [FUSC2114X75N]
F4  0.5A  [FUSC2114X75N]
J4  282834-2  [282834-2_1]
J5  282834-2  [282834-2_1]
J6  282834-2  [282834-2_1]
J7  282834-2  [282834-2_1]
Q1  AO3401A  [AO-SOT-23-3L_V]
Q2  2N7002-7-F  [FP-SOT23-MFG]
Q3  AO3401A  [AO-SOT-23-3L_V]
Q4  AO3401A  [AO-SOT-23-3L_V]
Q5  2N7002-7-F  [FP-SOT23-MFG]
Q6  AO3401A  [AO-SOT-23-3L_V]
Q7  AO3401A  [AO-SOT-23-3L_V]
Q8  2N7002-7-F  [FP-SOT23-MFG]
Q9  AO3401A  [AO-SOT-23-3L_V]
Q10  AO3401A  [AO-SOT-23-3L_V]
Q11  2N7002-7-F  [FP-SOT23-MFG]
Q12  AO3401A  [AO-SOT-23-3L_V]
R17  value 10k  [RESC0402(1005)_L]  (hidden comment: Resistor 10K  +/-1 % 0402 63 mW)
R18  value 100R  [RESC0402(1005)_L]  (hidden comment: Resistor 100R +/-1 % 0402 63 mW)
R19  value 10k  [RESC0402(1005)_L]  (hidden comment: Resistor 10K  +/-1 % 0402 63 mW)
R20  value 10k  [RESC0402(1005)_L]  (hidden comment: Resistor 10K  +/-1 % 0402 63 mW)
R21  value 100k  [RESC0402(1005)_L]  (hidden comment: Resistor 100K +/-1 % 0402 63 mW)
R22  value 10k  [RESC0402(1005)_L]  (hidden comment: Resistor 10K  +/-1 % 0402 63 mW)
R23  value 5k1  [RESC0402(1005)_L]  (hidden comment: Resistor 5.1K +/-1 % 0402 63 mW)
R24  value 2k7  [RESC0402(1005)_L]  (hidden comment: Resistor 2.7K +/-1 % 0402 63 mW)
R25  value 100R  [RESC0402(1005)_L]  (hidden comment: Resistor 100R +/-1 % 0402 63 mW)
R26  value 10k  [RESC0402(1005)_L]  (hidden comment: Resistor 10K  +/-1 % 0402 63 mW)
R27  value 10k  [RESC0402(1005)_L]  (hidden comment: Resistor 10K  +/-1 % 0402 63 mW)
R28  value 10k  [RESC0402(1005)_L]  (hidden comment: Resistor 10K  +/-1 % 0402 63 mW)
R29  value 5k1  [RESC0402(1005)_L]  (hidden comment: Resistor 5.1K +/-1 % 0402 63 mW)
R30  value 2k7  [RESC0402(1005)_L]  (hidden comment: Resistor 2.7K +/-1 % 0402 63 mW)
R31  value 100k  [RESC0402(1005)_L]  (hidden comment: Resistor 100K +/-1 % 0402 63 mW)
R32  value 10k  [RESC0402(1005)_L]  (hidden comment: Resistor 10K  +/-1 % 0402 63 mW)
R33  value 100R  [RESC0402(1005)_L]  (hidden comment: Resistor 100R +/-1 % 0402 63 mW)
R34  value 10k  [RESC0402(1005)_L]  (hidden comment: Resistor 10K  +/-1 % 0402 63 mW)
R35  value 10k  [RESC0402(1005)_L]  (hidden comment: Resistor 10K  +/-1 % 0402 63 mW)
R36  value 10k  [RESC0402(1005)_L]  (hidden comment: Resistor 10K  +/-1 % 0402 63 mW)
R37  value 100k  [RESC0402(1005)_L]  (hidden comment: Resistor 100K +/-1 % 0402 63 mW)
R38  value 10k  [RESC0402(1005)_L]  (hidden comment: Resistor 10K  +/-1 % 0402 63 mW)
R39  value 5k1  [RESC0402(1005)_L]  (hidden comment: Resistor 5.1K +/-1 % 0402 63 mW)
R40  value 2k7  [RESC0402(1005)_L]  (hidden comment: Resistor 2.7K +/-1 % 0402 63 mW)
R41  value 100R  [RESC0402(1005)_L]  (hidden comment: Resistor 100R +/-1 % 0402 63 mW)
R42  value 10k  [RESC0402(1005)_L]  (hidden comment: Resistor 10K  +/-1 % 0402 63 mW)
R43  value 10k  [RESC0402(1005)_L]  (hidden comment: Resistor 10K  +/-1 % 0402 63 mW)
R44  value 10k  [RESC0402(1005)_L]  (hidden comment: Resistor 10K  +/-1 % 0402 63 mW)
R45  value 10k  [RESC0402(1005)_L]  (hidden comment: Resistor 10K  +/-1 % 0402 63 mW)
R46  value 100k  [RESC0402(1005)_L]  (hidden comment: Resistor 100K +/-1 % 0402 63 mW)
R47  value 5k1  [RESC0402(1005)_L]  (hidden comment: Resistor 5.1K +/-1 % 0402 63 mW)
R48  value 2k7  [RESC0402(1005)_L]  (hidden comment: Resistor 2.7K +/-1 % 0402 63 mW)

### Blocks framed on the sheet
IGNITERS: C38 F1 J4 Q2-Q4 R17-R24
IGNITION_CIRCUT_2: C39 F2 J5 Q5-Q7 R25-R32
IGNITION_CIRCUT_3: C40 F3 J6 Q8-Q10 R33-R40
IGNITION_CIRCUT_4: C41 F4 J7 Q1 Q11 Q12 R41-R48

### Ports
IGN_DET[1..4] (out, see SYSTEM_OVERVIEW[3C], MCU[5A]), IGN_EN[1..4] (in, see SYSTEM_OVERVIEW[3C], MCU[5A])

### Nets
GND: J4.1 J5.1 J6.1 J7.1 Q2.2(S) Q5.2(S) Q8.2(S) Q11.2(S) R17.1 R22.1 R24.2 R26.1 R30.2 R32.1 R35.1 R38.1 R40.2 R42.1 R45.1 R48.2
VBAT: C38.2 C39.2 C40.2 C41.2 Q1.2(SOURCE) Q3.2(SOURCE) Q4.2(SOURCE) Q6.2(SOURCE) Q7.2(SOURCE) Q9.2(SOURCE) Q10.2(SOURCE) Q12.2(SOURCE) R19.2 R20.2 R27.2 R28.2 R34.2 R36.2 R43.2 R44.2
IGN_DET1: R21.2 R22.2  [project net GPIO29]
IGN_DET2: R31.2 R32.2  [project net GPIO28]
IGN_DET3: R37.2 R38.2  [project net GPIO27]
IGN_DET4: R45.2 R46.2  [project net GPIO26]
IGN_EN1: R17.2 R18.1  [project net GPIO21]
IGN_EN2: R25.1 R26.2  [project net GPIO18]
IGN_EN3: R33.1 R35.2  [project net GPIO20]
IGN_EN4: R41.1 R42.2  [project net GPIO19]
NetC38_1: C38.1 Q2.3(D) Q3.1(GATE) Q4.1(GATE) R19.1
NetC39_1: C39.1 Q5.3(D) Q6.1(GATE) Q7.1(GATE) R27.1
NetC40_1: C40.1 Q8.3(D) Q9.1(GATE) Q10.1(GATE) R34.1
NetC41_1: C41.1 Q1.1(GATE) Q11.3(D) Q12.1(GATE) R43.1
NetF1_1: F1.1 J4.2 R23.2 R24.1
NetF1_2: F1.2 Q3.3(DRAIN) Q4.3(DRAIN) R20.1 R21.1 R23.1
NetF2_1: F2.1 J5.2 R29.2 R30.1
NetF2_2: F2.2 Q6.3(DRAIN) Q7.3(DRAIN) R28.1 R29.1 R31.1
NetF3_1: F3.1 J6.2 R39.2 R40.1
NetF3_2: F3.2 Q9.3(DRAIN) Q10.3(DRAIN) R36.1 R37.1 R39.1
NetF4_1: F4.1 J7.2 R47.2 R48.1
NetF4_2: F4.2 Q1.3(DRAIN) Q12.3(DRAIN) R44.1 R46.1 R47.1
NetQ2_1: Q2.1(G) R18.2
NetQ5_1: Q5.1(G) R25.2
NetQ8_1: Q8.1(G) R33.2
NetQ11_1: Q11.1(G) R41.2

### Buses and harness runs
bus IGN_DET[1..4] = port IGN_DET[1..4]
bus IGN_EN[1..4] = port IGN_EN[1..4]

### Notes on the sheet
- IGNITION_CIRCUT_1
- Title:
- Author:
- Konrad Fura
- SIGNALS
- IGNITERS DETECTION & ENABLE SIGNALS
- Sheet number:
- Modified:
- Description:
- Reviewers:
- Labels drawn without touching a wire or pin: IGN_DET1, IGN_DET2, IGN_DET3, IGN_DET4, IGN_EN1, IGN_EN2, IGN_EN3, IGN_EN4

### Library data of the parts
C38-C41 = CMP-001-00063-3: as C16 on sheet SENSORS; Mounting Technology: SMT; Max Operating Temperature: 85°C; Voltage Rating: 10V; Pins: 2; Case/Package: 0402; Min Operating Temperature: -55°C
F1-F4 = 0805L020_24YR: as F6 on sheet IO; Datasheet Link: https://m.littelfuse.com/media?resourcetype=datasheets&itemid=3b1fa5dc-24aa-4363-b543-edb057c2fffa&filename=littelfuse-ptc-0805l-datasheet; Height: 0.75mm; Mouser Part Number: 576-0805L020/24YR; Mouser Price/Stock: https://www.mouser.co.uk/ProductDetail/Littelfuse/0805L020-24YR?qs=AQlKX63v8Rtx0r%252BHTgklTQ%3D%3D
J4-J7 = 282834-2: Connector; Manufacturer_Name: TE Connectivity; Datasheet Link: https://www.te.com/commerce/DocumentDelivery/DDEController?Action=srchrtrv&DocNm=1-1773458-1_EURO_STYLE_QRG&DocType=Data+Sheet&DocLang=English&PartCntxt=282834-2&DocFormat=pdf; Manufacturer_Part_Number: 282834-2; Mouser Part Number: 571-282834-2; Mouser Price/Stock: https://www.mouser.co.uk/ProductDetail/TE-Connectivity/282834-2?qs=A%252Bip%252BNCYi6N8cVKuk8xDog%3D%3D; Arrow Part Number: 282834-2; Arrow Price/Stock: https://www.arrow.com/en/products/282834-2/te-connectivity?region=europe
Q1 Q3 Q4 Q6 Q7 Q9 Q10 Q12 = CMP-2000-05778-1: P-Channel MOSFET, 30 V, 4 A, -55 to 150 degC, 3-Pin SOT-23-3L, RoHS, Tape and Reel; Manufacturer: Alpha and Omega; Output Power (Max): NotRequiredW; Power Dissipation: 1.4W; Rad Hardened: No; Drain Efficiency: NotRequired%; Drain-Source On-Volt: 30V; Noise Figure: NotRequireddB; Frequency (Max): NotRequiredMHz; Number of  Elements: 1; Gate-Source Voltage (Max): ?12V; Drain Current (Max): 4A; Channel Mode: Enhancement; Drain-Source On-Res: 0.044ohm; Type: PowerMOSFET; Polarity: P; Package URL: http://www.aosmd.com/res/packaging_information/SOT-23-3L.pdf; Datasheet URL: http://www.aosmd.com/res/data_sheets/AO3401A.pdf; Package Type: SOT-23; Package Description: 3-Pin Small Outline Transistor, Body 2.95 x 1.6 mm, Pitch 0.95 mm; Mounting: SurfaceMount; Manufacturer URL: http://www.aosmd.com/; Continuous Drain Current: 4A; Package Reference: SOT-23-3L; Mounting Technology: SurfaceMount; Operating Temperature Classification: Military; Power Gain: NotRequireddB; Datasheet Version: Rev. 3, 03/2011; Operating Temp Range: -55Cto150C; Pin Count: 3
Q2 Q5 Q8 Q11 = CMP-2000-04929-2: as Q13 on sheet IO; Termination: SMD/SMT; Weight: 0.000282oz; Radiation Hardening: No; Max Operating Temperature: 150°C; On-State Resistance: 7.5R; Mount: Surface Mount; Current Rating: 115mA; Contact Plating: Tin; Lead Free: Lead Free; Min Operating Temperature: -55°C; Number of Pins: 3; REACH SVHC: No SVHC; Drain to Source Voltage (Vdss): 60V; Width: 1.3mm; Package Quantity: 3000; Length: 2.9mm; Case/Package: SOT-23; Number of Channels: 1; Dual Supply Voltage: 60V; Packaging: Tape and Reel; Height: 1mm; Voltage Rating (DC): 60V; Nominal Vgs: 2.5V; Continuous Drain Current (ID): 115mA; Voltage: 60V; Rds On Max: 7.5R
R17 R19 R20 R22 R26-R28 R32 R34-R36 R38 R42-R45 = CMP-009-00149-3: as R6 on sheet MCU; Min Operating Temperature: -55°C; Case/Package: 0402; Max Operating Temperature: 155°C; Pins: 2
R18 R25 R33 R41 = CMP-009-00167-3: as R54 on sheet IO; Min Operating Temperature: -55°C; Case/Package: 0402; Pins: 2; Max Operating Temperature: 155°C
R21 R31 R37 R46 = CMP-009-00168-3: as R3 on sheet IO; Max Operating Temperature: 155°C; Min Operating Temperature: -55°C; Pins: 2; Case/Package: 0402
R23 R29 R39 R47 = CMP-009-00168-3: Chip Resistor, 5.1 kOhms, +/-1 %, 63 mW, -55 to 155 degC, 0402; Tolerance: 1%; Power: 63mW; Max Operating Temperature: 155°C; Min Operating Temperature: -55°C; Pins: 2; Case/Package: 0402
R24 R30 R40 R48 = CMP-009-00168-3: Chip Resistor, 2.7 kOhms, +/-1 %, 63 mW, -55 to 155 degC, 0402; Tolerance: 1%; Power: 63mW; Max Operating Temperature: 155°C; Min Operating Temperature: -55°C; Pins: 2; Case/Package: 0402